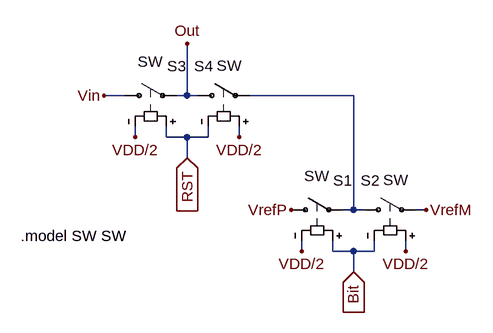
[diagram p0: schematic SwitchModule.asc]
SwitchModule.asc, the LTspice schematic file:
Version 4
SHEET 1 880 680
WIRE -176 -32 -208 -32
WIRE -80 -32 -80 -112
WIRE -80 -32 -96 -32
WIRE -64 -32 -80 -32
WIRE 176 -32 16 -32
WIRE -160 32 -160 16
WIRE -112 32 -112 16
WIRE -80 32 -112 32
WIRE -48 32 -48 16
WIRE -48 32 -80 32
WIRE 0 32 0 16
WIRE -80 64 -80 32
WIRE 176 144 176 -32
WIRE 176 144 160 144
WIRE 192 144 176 144
WIRE 288 144 272 144
WIRE 96 208 96 192
WIRE 144 208 144 192
WIRE 176 208 144 208
WIRE 208 208 208 192
WIRE 208 208 176 208
WIRE 256 208 256 192
WIRE 176 240 176 208
FLAG 176 240 Bit
IOPIN 176 240 In
FLAG 80 144 VrefP
FLAG 96 208 VDD/2
FLAG 256 208 VDD/2
FLAG -80 64 RST
IOPIN -80 64 In
FLAG -160 32 VDD/2
FLAG 0 32 VDD/2
FLAG -208 -32 Vin
FLAG -80 -112 Out
FLAG 288 144 VrefM
SYMBOL sw 64 144 R270
WINDOW 0 45 81 VRight 0
WINDOW 3 52 36 VRight 0
SYMATTR InstName S1
SYMBOL sw 176 144 R270
WINDOW 0 45 40 VLeft 0
WINDOW 3 46 84 VLeft 0
SYMATTR InstName S2
SYMBOL sw -192 -32 R270
WINDOW 0 45 81 VRight 0
WINDOW 3 52 36 VRight 0
SYMATTR InstName S3
SYMBOL sw -80 -32 R270
WINDOW 0 45 40 VLeft 0
WINDOW 3 46 84 VLeft 0
SYMATTR InstName S4
TEXT -336 184 Left 0 !.model SW SW

The netlist it stands for:
* SwitchModule.asc
S1 VrefP N001 Bit VDD/2 SW
S2 N001 VrefM VDD/2 Bit SW
S3 Vin Out RST VDD/2 SW
S4 Out N001 VDD/2 RST SW
.model SW SW
.backanno
.end